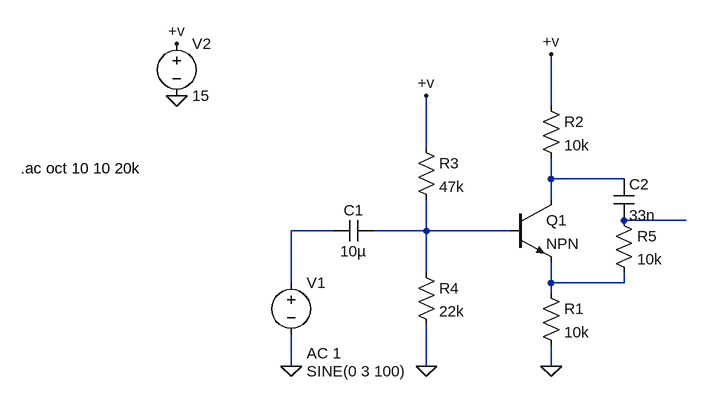
[diagram p0: schematic arbitrary phase shifter.asc]
arbitrary phase shifter.asc, the LTspice schematic file:
Version 4
SHEET 1 880 680
WIRE 464 -160 464 -240
WIRE 272 -96 272 -176
WIRE 464 -48 464 -80
WIRE 576 -48 464 -48
WIRE 464 -16 464 -48
WIRE 672 16 576 16
WIRE 128 32 64 32
WIRE 272 32 272 -16
WIRE 272 32 192 32
WIRE 400 32 272 32
WIRE 272 96 272 32
WIRE 64 112 64 32
WIRE 464 112 464 80
WIRE 576 112 576 96
WIRE 576 112 464 112
WIRE 464 128 464 112
WIRE 64 240 64 192
WIRE 272 240 272 176
WIRE 464 240 464 208
FLAG 64 240 0
FLAG 464 240 0
FLAG 272 240 0
FLAG -112 -176 0
FLAG -112 -256 +v
FLAG 272 -176 +v
FLAG 464 -240 +v
SYMBOL voltage 64 96 R0
WINDOW 123 24 124 Left 2
WINDOW 39 0 0 Left 0
WINDOW 3 24 152 Left 2
SYMATTR Value2 AC 1
SYMATTR InstName V1
SYMATTR Value SINE(0 3 100)
SYMBOL npn 400 -16 R0
SYMATTR InstName Q1
SYMBOL res 448 112 R0
SYMATTR InstName R1
SYMATTR Value 10k
SYMBOL res 448 -176 R0
SYMATTR InstName R2
SYMATTR Value 10k
SYMBOL cap 192 16 R90
WINDOW 0 0 32 VBottom 2
WINDOW 3 32 32 VTop 2
SYMATTR InstName C1
SYMATTR Value 10µ
SYMBOL res 256 -112 R0
SYMATTR InstName R3
SYMATTR Value 47k
SYMBOL res 256 80 R0
SYMATTR InstName R4
SYMATTR Value 22k
SYMBOL voltage -112 -272 R0
WINDOW 123 0 0 Left 0
WINDOW 39 0 0 Left 0
SYMATTR InstName V2
SYMATTR Value 15
SYMBOL res 560 0 R0
SYMATTR InstName R5
SYMATTR Value 10k
SYMBOL cap 560 -48 R0
SYMATTR InstName C2
SYMATTR Value 33n
TEXT -352 -64 Left 2 !.ac oct 10 10 20k

The netlist it stands for:
* arbitrary phase shifter.asc
V1 N003 0 SINE(0 3 100) AC 1
Q1 N001 N004 N005 0 NPN
R1 N005 0 10k
R2 +v N001 10k
C1 N004 N003 10µ
R3 +v N004 47k
R4 N004 0 22k
V2 +v 0 15
R5 N002 N005 10k
C2 N001 N002 33n
.model NPN NPN
.model PNP PNP
.lib standard.bjt
.ac oct 10 10 20k
.backanno
.end